# Altium schematic sheet Interface.SchDoc
size A4
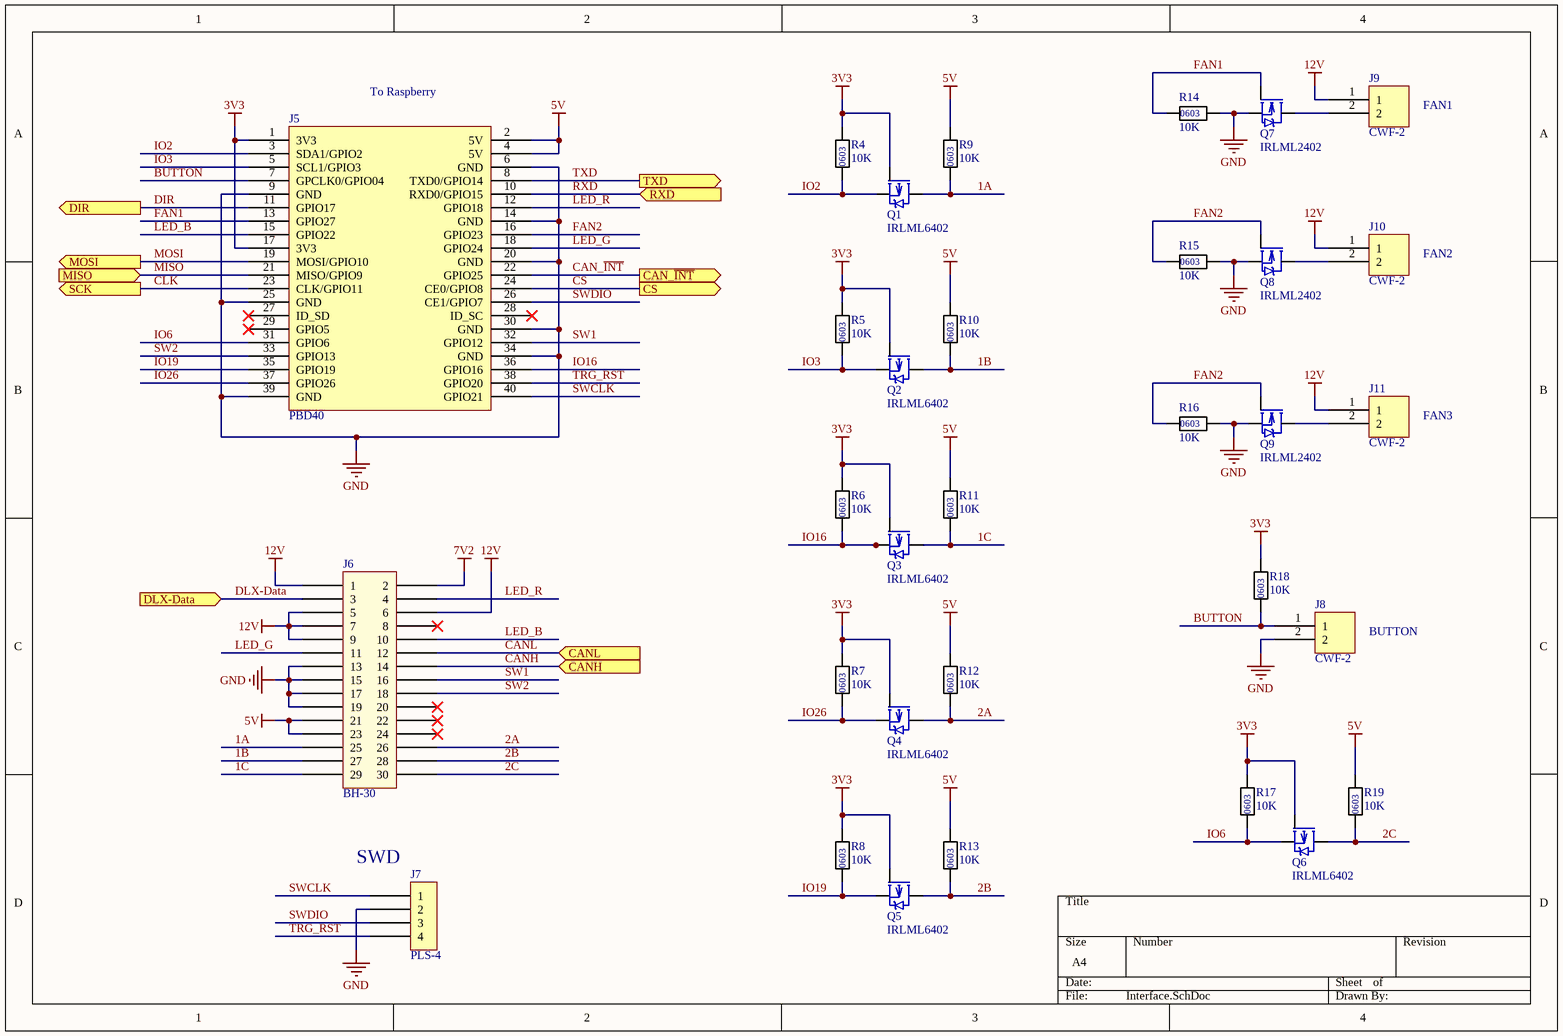
[diagram p0: Interface.SchDoc]

## Parts
J5  PBD40  [PLD40]
J6  BH-30  [BH-30]
J7  PLS-4  [PLS-4]
J8  CWF-2  [CWF-2]
J9  CWF-2  [CWF-2]
J10  CWF-2  [CWF-2]
J11  CWF-2  [CWF-2]
Q1  IRLML6402  [SOT23]
Q2  IRLML6402  [SOT23]
Q3  IRLML6402  [SOT23]
Q4  IRLML6402  [SOT23]
Q5  IRLML6402  [SOT23]
Q6  IRLML6402  [SOT23]
Q7  IRLML2402  [SOT23]
Q8  IRLML2402  [SOT23]
Q9  IRLML2402  [SOT23]
R4  10K  [CHIP_R_0603]
R5  10K  [CHIP_R_0603]
R6  10K  [CHIP_R_0603]
R7  10K  [CHIP_R_0603]
R8  10K  [CHIP_R_0603]
R9  10K  [CHIP_R_0603]
R10  10K  [CHIP_R_0603]
R11  10K  [CHIP_R_0603]
R12  10K  [CHIP_R_0603]
R13  10K  [CHIP_R_0603]
R14  10K  [CHIP_R_0603]
R15  10K  [CHIP_R_0603]
R16  10K  [CHIP_R_0603]
R17  10K  [CHIP_R_0603]
R18  10K  [CHIP_R_0603]
R19  10K  [CHIP_R_0603]

## Ports
CAN_~{INT} (out), CANH (in), CANL (in), CS (out), DIR (out), DLX-Data (in), MISO (in), MOSI (out), RXD (in), SCK (out), TXD (out)

## Nets
3V3: J5.1(3V3) J5.17(3V3) Q1.1(G) Q2.1(G) Q3.1(G) Q4.1(G) Q5.1(G) Q6.1(G) R4.2 R5.2 R6.2 R7.2 R8.2 R17.2 R18.2
5V: J5.2(5V) J5.4(5V) J6.21 J6.23 R9.2 R10.2 R11.2 R12.2 R13.2 R19.2
7V2: J6.2
12V: J6.1 J6.5 J6.6 J6.7 J6.9 J9.1 J10.1 J11.1
GND: J5.6(GND) J5.9(GND) J5.14(GND) J5.20(GND) J5.25(GND) J5.30(GND) J5.34(GND) J5.39(GND) J6.13 J6.15 J6.17 J6.19 J7.2 J8.2 Q7.2(S) Q8.2(S) Q9.2(S) R14.2 R15.2 R16.2
1A: J6.25 Q1.3(D) R9.1
1B: J6.27 Q2.3(D) R10.1
1C: J6.29 Q3.3(D) R11.1
2A: J6.26 Q4.3(D) R12.1
2B: J6.28 Q5.3(D) R13.1
2C: J6.30 Q6.3(D) R19.1
BUTTON: J5.7(GPCLK0/GPIO04) J8.1 R18.1
CAN_~{INT}: J5.22(GPIO25) ; port CAN_~{INT}
CANH: J6.14 ; port CANH
CANL: J6.12 ; port CANL
CLK: J5.23(CLK/GPIO11) ; port SCK
CS: J5.24(CE0/GPIO8) ; port CS
DIR: J5.11(GPIO17) ; port DIR
DLX-Data: J6.3 ; port DLX-Data
FAN1: J5.13(GPIO27) Q7.1(G) R14.1
FAN2: J5.16(GPIO23) Q8.1(G) Q9.1(G) R15.1 R16.1
IO2: J5.3(SDA1/GPIO2) Q1.2(S) R4.1
IO3: J5.5(SCL1/GPIO3) Q2.2(S) R5.1
IO6: J5.31(GPIO6) Q6.2(S) R17.1
IO16: J5.36(GPIO16) Q3.2(S) R6.1
IO19: J5.35(GPIO19) Q5.2(S) R8.1
IO26: J5.37(GPIO26) Q4.2(S) R7.1
LED_B: J5.15(GPIO22) J6.10
LED_G: J5.18(GPIO24) J6.11
LED_R: J5.12(GPIO18) J6.4
MISO: J5.21(MISO/GPIO9) ; port MISO
MOSI: J5.19(MOSI/GPIO10) ; port MOSI
RXD: J5.10(RXD0/GPIO15) ; port RXD
SW1: J5.32(GPIO12) J6.16
SW2: J5.33(GPIO13) J6.18
SWCLK: J5.40(GPIO21) J7.1
SWDIO: J5.26(CE1/GPIO7) J7.3
TRG_RST: J5.38(GPIO20) J7.4
TXD: J5.8(TXD0/GPIO14) ; port TXD
NetJ9_2: J9.2 Q7.3(D)
NetJ10_2: J10.2 Q8.3(D)
NetJ11_2: J11.2 Q9.3(D)

Not connected (* = marked no-connect by the designer): J5 27(ID_SD)* 28(ID_SC)* 29(GPIO5)*; J6 8* 20* 22* 24*

## Notes on the sheet
- (near J5) To Raspberry
- FAN1
- FAN2
- FAN3
- BUTTON
- (near J7) SWD
- (in symbol RES_0603) 0603

## Library data of the parts
J5 = RPiGPIO
J8-J11 = CWF-2: Connector
Q1-Q6 = IRLML6402: p-chanal MOSFET
Q7-Q9 = IRLML2402: n-chanal MOSFET
R4-R19 = RES_0603